# EAGLE schematic ir_transmitter (EAGLE 9.6.2)
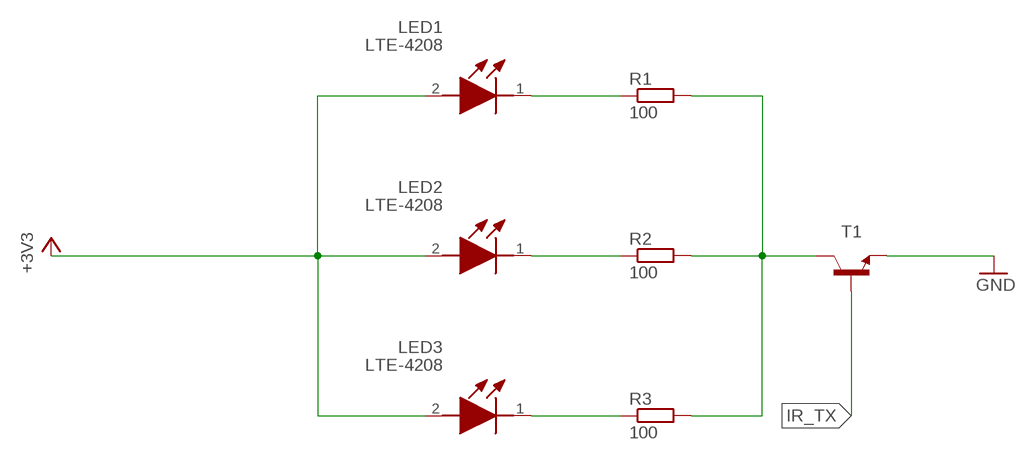
[diagram p0: schematic, sheet 1]

## Parts
LED1  LTE-4208  [LTE4208]
LED2  LTE-4208  [LTE4208]
LED3  LTE-4208  [LTE4208]
R1  100  R-EU_R1206  [R1206]
R2  100  R-EU_R1206  [R1206]
R3  100  R-EU_R1206  [R1206]
T1  MMBT3904LT1-NPN-SOT23-BEC  [SOT23-BEC]

## Nets
+3V3: LED1.2(A) LED2.2(A) LED3.2(A)
GND: T1.E
IR_TX: T1.B
N$1: LED1.1(K) R1.1
N$2: LED2.1(K) R2.1
N$3: LED3.1(K) R3.1
N$4: R1.2 R2.2 R3.2 T1.C

## Library data of the parts
LED1-LED3 = LTE-4208:LTE-4208: Infrared Emitters Ired 940nm 5mm Water Clr 50mA Source: Datasheet <https://componentsearchengine.com/Datasheets/1/LTE-4208.pdf>; DESCRIPTION: Infrared Emitters Ired 940nm 5mm Water Clr 50mA; HEIGHT: 9.85mm; MANUFACTURER_NAME: Lite-On; MANUFACTURER_PART_NUMBER: LTE-4208; MOUSER_PART_NUMBER: 859-LTE4208; MOUSER_PRICE-STOCK: https://www.mouser.com/Search/Refine.aspx?Keyword=859-LTE4208
R1-R3 = rcl:R-EU_: RESISTOR, European symbol; SPICEPREFIX: R
T1 = transistor:*-NPN-: NPN Transistror BF959 corrected 2008.03.06